# Altium schematic sheet PLD_LMT87.SchDoc: LM60
size A4; SheetTotal: 32
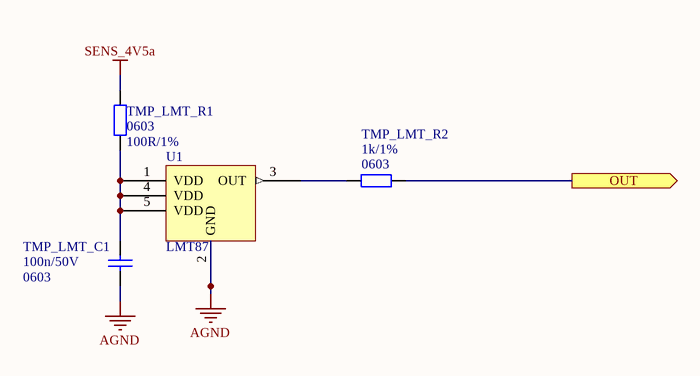
[diagram p0: PLD_LMT87.SchDoc]

## Parts
TMP_LMT_C1  Package: 0603  [SMD_Capacitor_0603]  (hidden comment: 100n/50V)
TMP_LMT_R1  Package: 0603  [SMD_Resistor_0603]  (hidden comment: 100R/1%)
TMP_LMT_R2  Package: 0603  [SMD_Resistor_0603]  (hidden comment: 1k/1%)
U1  LMT87  [SC70-LT5_N]

## Ports
OUT (out)

## Nets
AGND: TMP_LMT_C1.2 U1.2(GND)
SENS_4V5a: TMP_LMT_R1.2
OUT: TMP_LMT_R2.2 ; port OUT
NetTMP_LMT_C1_1: TMP_LMT_C1.1 TMP_LMT_R1.1 U1.1(VDD) U1.4(VDD) U1.5(VDD)
NetTMP_LMT_R2_1: TMP_LMT_R2.1 U1.3(OUT)

## Notes on the sheet
- Title:
- Project:
- Author:
- Model:
- Document Number:
- Checked by:
- Rev:
- Date:
- Approved by:
- Sheet:
- of
- File name:

## Library data of the parts
TMP_LMT_C1 = Cer_C0603T104K5RALTU: Ceramic Cap Kemet COTS 100n/50V X7R 0603; Manufacturer: Kemet; ManufacturerPartNumber: C0603T104K5RALTU; Value: 100n/50V
TMP_LMT_R1 = CRCW0603100RFKxxxx: 100R/1% Vishay CRCW 0603 Resistor. 100mW, 100ppm, 75V.; Manufacturer: Vishay; ManufacturerPartNumber: CRCW0603100RFKxxxx; Value: 100R/1%
TMP_LMT_R2 = CRCW06031K00FKxxxx: 1k/1% Vishay CRCW 0603 Resistor. 100mW, 100ppm, 75V.; Manufacturer: Vishay; ManufacturerPartNumber: CRCW06031K00FKxxxx; Value: 1k/1%
U1 = LMT87: Analog Temperature Sensors with Class-AB Output